# EAGLE design guider-shield (EAGLE 7.6.0)
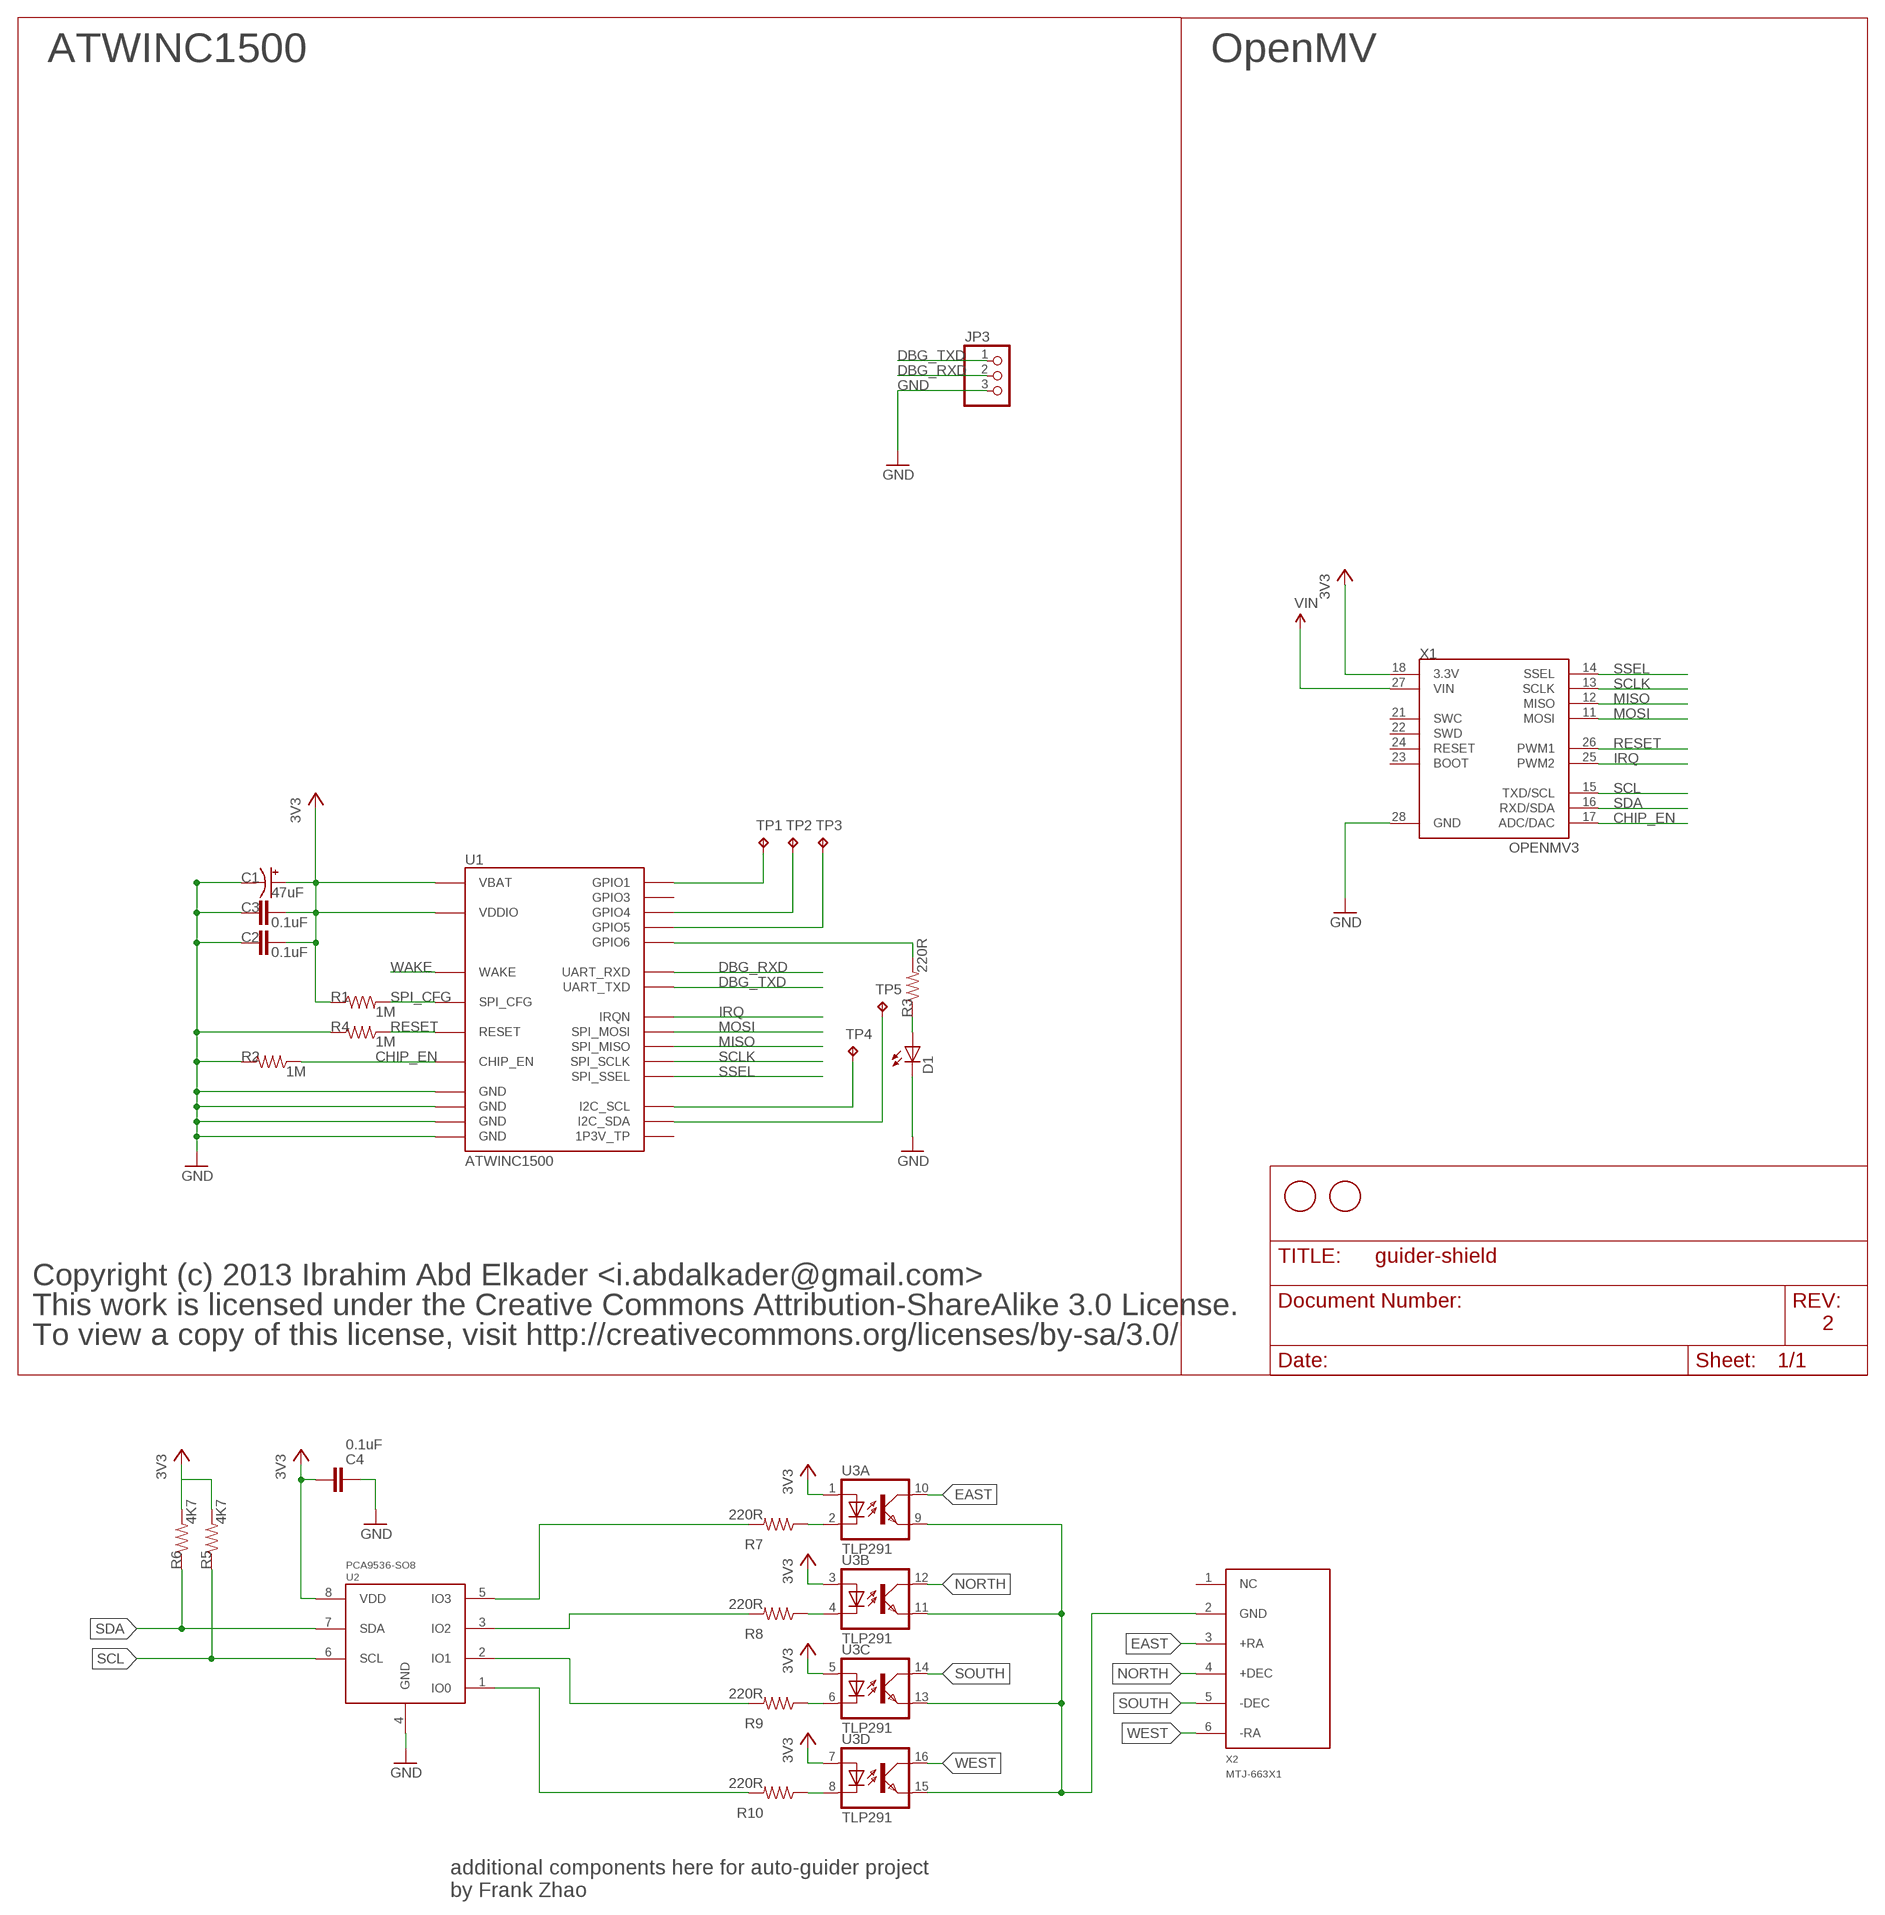
[diagram p0: schematic, sheet 1]

## Parts
C1  47uF  CAP_POL1206  [EIA3216]
C2  0.1uF  CAP0603-CAP  [0603-CAP]
C3  0.1uF  CAP0603-CAP  [0603-CAP]
C4  0.1uF  CAP0603-CAP  [0603-CAP]
D1  LED0603  [LED-0603]
JP3  PINHD-1X3  [1X03]
R1  1M  RESISTOR0603-RES  [0603-RES]
R2  1M  RESISTOR0603-RES  [0603-RES]
R3  220R  RESISTOR0603-RES  [0603-RES]
R4  1M  RESISTOR0603-RES  [0603-RES]
R5  4K7  RESISTOR0603-RES  [0603-RES]
R6  4K7  RESISTOR0603-RES  [0603-RES]
R7  220R  RESISTOR0603-RES  [0603-RES]
R8  220R  RESISTOR0603-RES  [0603-RES]
R9  220R  RESISTOR0603-RES  [0603-RES]
R10  220R  RESISTOR0603-RES  [0603-RES]
TP1  TPTP12R  [TP12R]
TP2  TPTP11R  [TP11R]
TP3  TPTP11R  [TP11R]
TP4  TPTP12R  [TP12R]
TP5  TPTP12R  [TP12R]
U1  ATWINC1500  [ATWINC1500]
U2  PCA9536-SO8  [SO08]
U3  TLP291  TLP283-4-SO016  [SO016]
U$1  FIDUCIAL  [FIDUCIAL_1MM]
U$2  FIDUCIAL  [FIDUCIAL_1MM]
X1  OPENMV3  [OPENMV3]
X2  MTJ-663X1  ST-4-MTJ-663X1  [MTJ-663X1]

## Nets
3V3: C1.A(+) C2.2 C3.2 C4.1 R1.1 R5.2 R6.2 U1.P$20(VBAT) U1.P$23(VDDIO) U2.8(VDD) U3.1(A:A) U3.3(B:A) U3.5(C:A) U3.7(D:A) X1.18(3.3V)
CHIP_EN: R2.1 U1.P$22(CHIP_EN) X1.17(ADC/DAC)
DBG_RXD: JP3.2 U1.P$19(UART_RXD)
DBG_TXD: JP3.1 U1.P$14(UART_TXD)
EAST: U3.10(A:COL) X2.3(+RA)
GND: C1.C(-) C2.1 C3.1 C4.2 D1.C JP3.3 R2.2 R4.2 U1.P$9(GND) U1.P$12(GND) U1.P$28(GND) U1.P$29(GND) U2.4(GND) X1.28(GND)
IRQ: U1.P$13(IRQN) X1.25(PWM2)
MISO: U1.P$17(SPI_MISO) X1.12(MISO)
MOSI: U1.P$15(SPI_MOSI) X1.11(MOSI)
N$1: R7.2 U2.5(IO3)
N$2: R8.2 U2.3(IO2)
N$8: R7.1 U3.2(A:C)
N$9: TP1.TP U1.P$21(GPIO1)
N$10: TP4.TP U1.P$2(I2C_SCL)
N$11: TP5.TP U1.P$3(I2C_SDA)
N$12: D1.A R3.1
N$13: TP2.TP U1.P$26(GPIO4)
N$14: TP3.TP U1.P$27(GPIO5)
N$15: R3.2 U1.P$1(GPIO6)
N$16: R8.1 U3.4(B:C)
N$20: R9.1 U3.6(C:C)
N$21: R10.1 U3.8(D:C)
N$22: R9.2 U2.2(IO1)
N$23: R10.2 U2.1(IO0)
N$24: U3.9(A:EMIT) U3.11(B:EMIT) U3.13(C:EMIT) U3.15(D:EMIT) X2.2(GND)
NORTH: U3.12(B:COL) X2.4(+DEC)
RESET: R4.1 U1.P$4(RESET) X1.26(PWM1)
SCL: R5.1 U2.6(SCL) X1.15(TXD/SCL)
SCLK: U1.P$18(SPI_SCLK) X1.13(SCLK)
SDA: R6.1 U2.7(SDA) X1.16(RXD/SDA)
SOUTH: U3.14(C:COL) X2.5(-DEC)
SPI_CFG: R1.2 U1.P$10(SPI_CFG)
SSEL: U1.P$16(SPI_SSEL) X1.14(SSEL)
VIN: X1.27(VIN)
WAKE: U1.P$11(WAKE)
WEST: U3.16(D:COL) X2.6(-RA)
Unconnected: U1.P$24(1P3V_TP) U1.P$25(GPIO3) X1.21(SWC) X1.22(SWD) X1.23(BOOT) X1.24(RESET) X2.1(NC)

## Notes on the sheet
- ATWINC1500 | OpenMV
- Copyright (c) 2013 Ibrahim Abd Elkader <i.abdalkader@gmail.com>
- This work is licensed under the Creative Commons Attribution-ShareAlike 3.0 License.
- 2
- To view a copy of this license, visit http://creativecommons.org/licenses/by-sa/3.0/
- additional components here for auto-guider project
  by Frank Zhao

## Library data of the parts
C1 = sfe:CAP_POL: Capacitor Polarized These are standard SMD and PTH capacitors. Normally 10uF, 47uF, and 100uF in electrolytic and tantalum varieties. Always verify the external diameter of the through hole cap, it varies with capacity, voltage, and manufacturer. The EIA devices should be standard.
C2-C4 = sfe:CAP: Capacitor Standard 0603 ceramic capacitor, and 0.1" leaded capacitor.
D1 = sfe:LED: LEDs Standard schematic elements and footprints for 5mm, 3mm, 1206, and 0603 sized LEDs. 5mm - Spark Fun Electronics SKU : COM-00529 (and others)
JP3 = adafruit-updated:PINHD-1X3: PIN HEADER
R1-R10 = sfe:RESISTOR: Resistor Basic schematic elements and footprints for 0603, 1206, and PTH resistors.
TP1-TP5 = testpad:TP: Test pad
U1 = mux:ATWINC1500
U2 = guider-shield:PCA9536
U3 = guider-shield:TLP283-4: TOSHIBA PHOTOCOUPLER GaAs IRED & PHOTO-TRANSISTOR Source: http://www.semicon.toshiba.co.jp/td/en/Opto/Photocoupler/en_20050928_TLP283_datasheet.pdf
U$1 U$2 = adafruit:FIDUCIAL: For use by pick and place machines to calibrate the vision/machine, 1mm By microbuilder.eu
X1 = openmv:OPENMV3
X2 = guider-shield:ST-4

## Net classes
1 vcc: width 1.016 mm, clearance 0.203 mm
2 antenna: width 0.363 mm, clearance 0.305 mm
3 1.8v: width 0.457 mm, clearance 0.254 mm

## Board
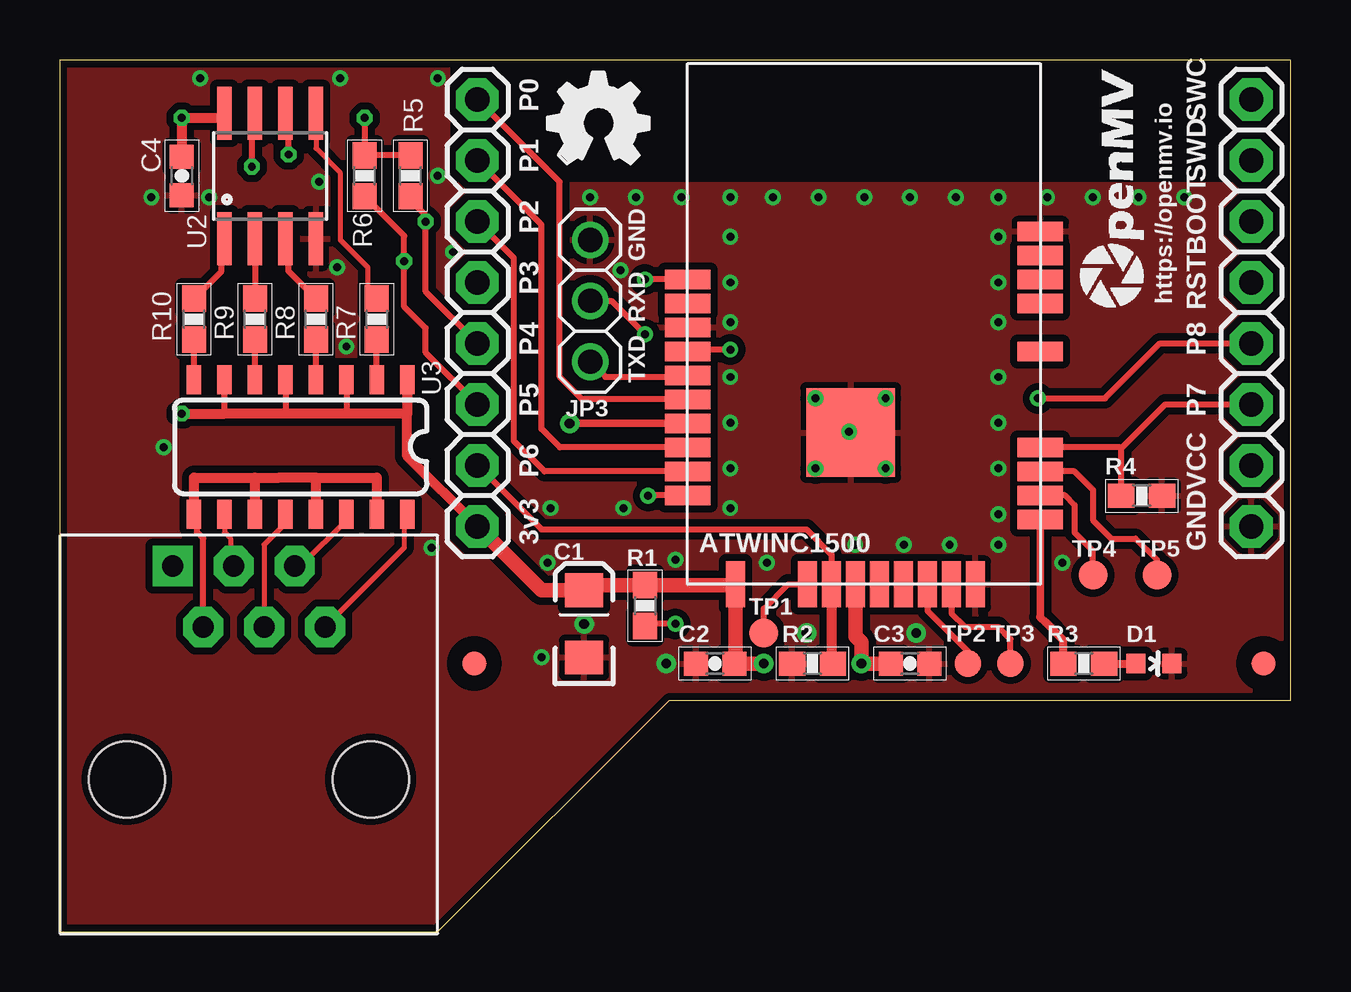
[diagram p1: board, top side]
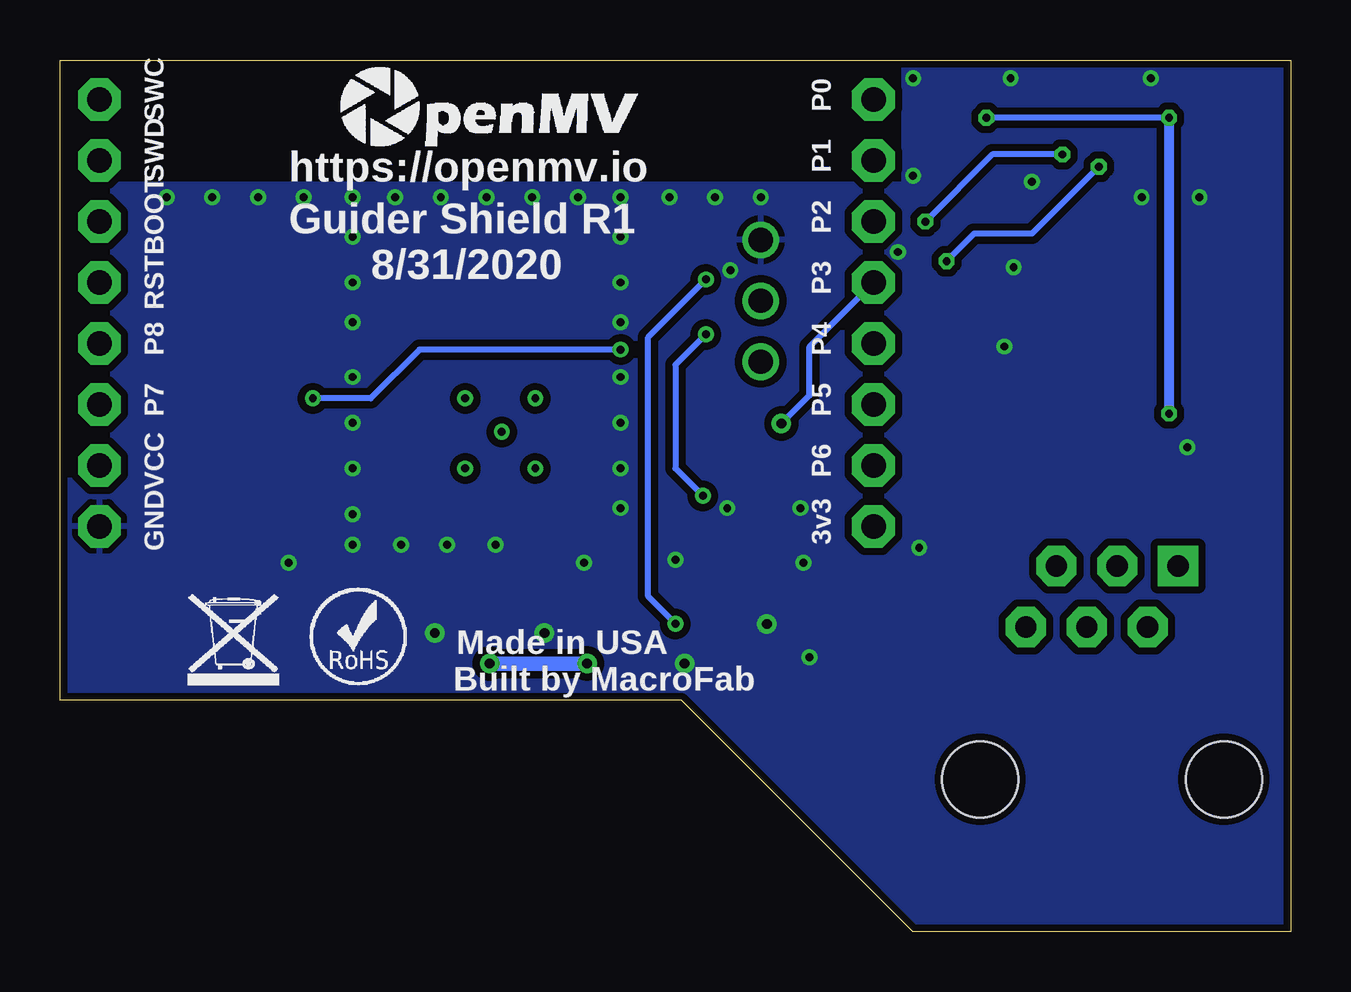
[diagram p2: board, bottom side, seen from below]

Size 51.31 x 36.32 mm. Coordinates in mm from the lower left corner, seen from the top.
Outline: 0,0 15.75,0 25.4,9.65 51.31,9.65 51.31,36.32 0,36.32 0,0
Copper layers (1*16): Top 0.035mm / dielectric 1.5mm / Bottom 0.035mm
Design rules "default": minimum track width 8mil, minimum drill 13mil, track to track 6mil, track to pad 6mil, pad to pad 6mil, via to via 6mil, smd to smd 6mil, copper to edge 5mil, drill to drill 10mil, minimum pad ring 10mil, minimum via ring 4mil, stop-mask expansion 2mil, vias tented up to drill 40mil, thermal gap 10mil

### Footprints (pad centres in the part's own frame; a part is rotated, then mirrored left to right if it is on the bottom)
EIA3216 = smd 1.4 x 1.6: A 1.4,0; C -1.4,0
0603-CAP = smd 1 x 1: 1 -0.8,0; 2 0.8,0
LED-0603 = smd 0.8 x 0.8: A 0,-0.75; C 0,0.75
1X03 = drill 1.016: 1 -2.54,0; 2 0,0; 3 2.54,0
0603-RES = smd 1.1 x 1: 1 -0.85,0; 2 0.85,0
TP12R = smd 1.2 x 1.2: TP 0,0
TP11R = smd 1.1 x 1.1: TP 0,0
ATWINC1500 = smd 1.9 x 0.8: P$1 14.7,2.7; P$2 14.7,3.7; P$3 14.7,4.7; P$4 14.7,5.7; P$5 14.7,9.7; P$6 14.7,11.7; P$7 14.7,12.7; P$8 14.7,13.7; P$9 14.7,14.7; P$10 0,12.7; P$11 0,11.7; P$12 0,10.7; P$13 0,9.7; P$14 0,8.7; P$15 0,7.7; P$16 0,6.7; P$17 0,5.7; P$18 0,4.7; P$19 0,3.7 | smd 0.8 x 1.9: P$20 2,0; P$21 5,0; P$22 6,0; P$23 7,0; P$24 8,0; P$25 9,0; P$26 10,0; P$27 11,0; P$28 12,0 | smd 3.7 x 3.7: P$29 6.8,6.32
SO08 = smd 0.61 x 2.21: 1 -1.905,-2.616; 2 -0.635,-2.616; 3 0.635,-2.616; 4 1.905,-2.616; 5 1.905,2.616; 6 0.635,2.616; 7 -0.635,2.616; 8 -1.905,2.616
SO016 = smd 0.6 x 1.2: 1 -4.445,-2.8; 2 -3.175,-2.8; 3 -1.905,-2.8; 4 -0.635,-2.8; 5 0.635,-2.8; 6 1.905,-2.8; 7 3.175,-2.8; 8 4.445,-2.8; 9 4.445,2.8; 10 3.175,2.8; 11 1.905,2.8; 12 0.635,2.8; 13 -0.635,2.8; 14 -1.905,2.8; 15 -3.175,2.8; 16 -4.445,2.8
FIDUCIAL_1MM = smd 1 x 1: 1 0,0
OPENMV3 = drill 1.016 pad 1.778 octagon: 11 1.651,19.304; 12 1.651,16.764; 13 1.651,14.224; 14 1.651,11.684; 15 1.651,9.144; 16 1.651,6.604; 17 1.651,4.064; 18 1.651,1.524; 21 33.909,19.304; 22 33.909,16.764; 23 33.909,14.224; 24 33.909,11.684; 25 33.909,9.144; 26 33.909,6.604; 27 33.909,4.064; 28 33.909,1.524
MTJ-663X1 = drill 0.889 pad 1.676 square: 1 -3.175,8.89 | drill 0.889 pad 1.676 octagon: 2 -1.905,6.35; 3 -0.635,8.89; 4 0.635,6.35; 5 1.905,8.89; 6 3.175,6.35 | hole 3.175: -5.08,0; 5.08,0

### Placement (x,y rotation side)
C1  21.84,12.83 90 top
C2  27.3,11.18 0 top
C3  35.43,11.18 180 top
C4  5.08,31.5 270 top
D1  45.59,11.18 270 top
JP3  22.1,26.29 90 top
R1  24.38,13.59 270 top
R2  31.37,11.18 180 top
R3  42.67,11.18 180 top
R4  45.09,18.16 0 top
R5  14.6,31.5 90 top
R6  12.7,31.5 90 top
R7  13.21,25.53 90 top
R8  10.67,25.53 90 top
R9  8.13,25.53 90 top
R10  5.59,25.53 90 top
TP1  29.34,12.45 0 top
TP2  37.85,11.18 0 top
TP3  39.62,11.18 0 top
TP4  43.05,14.86 0 top
TP5  45.72,14.86 0 top
U1  26.16,14.48 0 top
U2  8.76,31.5 0 top
U3  10.03,20.19 180 top
U$1  17.27,11.18 0 top
U$2  50.16,11.18 0 top
U$4  [OMV-LOGO]  39.75,32.51 0 bottom
U$5  [ROHS]  40.89,10.29 0 bottom
U$6  [WEEE]  45.97,10.29 0 bottom
U$7  [OSHW_FILLX150_NOTEXT]  20.32,32 0 top
U$10  [OMV-LOGO-SMALL]  45.34,25.91 90 top
X1  15.75,15.37 0 top
X2  7.87,6.35 0 top

### Tracks (layer width: path | path; a pad name or v marks a point on that pad's centre or on a via)
3V3  (via drill 0.33, 0.41)
  Top 0.254: 6.86,21.59 U3.7 | U3.5 9.4,21.59 | U3.3 11.94,21.59 | R5.2 R6.2 v12.7,33.91
  Top 0.406: U3.1 14.48,21.59 | 14.48,21.59 11.94,21.59 9.4,21.59 6.86,21.59 v5.08,21.59 | X1.18 14.48,19.81 14.48,21.59 | U2.8 6.86,33.91 v5.08,33.91 C4.1
  Top 0.61: C3.2 v33.4,11.18 33.4,12.06 33.16,12.3 U1.P$23 | v29.34,11.18 C2.2 28.16,11.23 U1.P$20 28.12,14.44 R1.1 22.06,14.44 C1.A 20.06,14.23 X1.18
  Bottom 0.254: v5.08,33.91 v12.7,33.91
  Bottom 0.406: v5.08,33.91 v5.08,21.59
  Bottom 0.61: v33.4,11.18 v29.34,11.18
CHIP_EN
  Top 0.254: U1.P$22 32.16,15.72 31.12,16.76 20.07,16.76 X1.17
  Top 0.406: U1.P$22 32.16,11.23 R2.1
DBG_RXD  (via drill 0.33)
  Top 0.254: U1.P$19 24.53,18.18 v24.51,18.16 | JP3.2 22.99,26.29 v24.38,24.89
  Bottom 0.254: v24.51,18.16 25.65,19.3 25.65,23.62 v24.38,24.89
DBG_TXD
  Top 0.254: JP3.1 22.73,23.11 26.1,23.11 U1.P$14
EAST
  Top 0.203: U3.10 6.86,16.64 7.11,16.38 7.11,15.37 X2.3
GND  (via drill 0.33, 0.41)
  other vias: 41.78,15.37 20.32,15.37 21.84,12.83 22.1,30.61 24,30.61 25.91,30.61 27.94,30.61 29.72,30.61 37.34,30.61 39.12,30.61 41.15,30.61 43.05,30.61 44.96,30.61 46.86,30.61 35.43,30.61 33.53,30.61 31.62,30.61 39.12,28.96 27.94,28.96 39.12,19.3 39.12,17.4 35.69,12.45 29.46,15.37 27.94,21.21 39.12,23.11 39.12,27.05 39.12,25.4 27.94,27.05 27.94,25.4 27.94,19.3 39.12,21.21 25.65,15.49 27.94,17.65 27.94,23.11 23.37,27.56 33.15,16.13 23.49,17.65 35.18,16.13 37.08,16.13 39.12,16.13 25.27,11.18 31.12,12.45 20.45,17.65 11.94,24.38 11.56,27.69 6.22,30.61 3.81,30.61 15.75,31.5 11.68,35.56 15.75,35.56 4.32,20.19 5.84,35.56 10.79,31.24 16.38,28.32 15.49,16 20.07,11.43
  pour Top (isolate 0.305, rank 2): 0,0 0,36.32 16.13,36.32 16.13,31.12 51.31,31.12 51.31,9.65 25.4,9.65 15.75,0
  pour Bottom (isolate 0.305, rank 2): 0,0 0,36.32 16.13,36.32 16.13,31.12 51.31,31.12 51.31,9.65 25.4,9.65 15.75,0
IRQ  (via drill 0.33)
  Top 0.254: v27.94,24.26 26.24,24.26 U1.P$13 | v40.77,22.23 43.56,22.23 45.85,24.51 X1.25
  Bottom 0.254: v27.94,24.26 36.32,24.26 38.35,22.23 v40.77,22.23
MISO
  Top 0.254: U1.P$17 20.84,20.18 20.07,20.95 20.07,29.46 X1.12
MOSI
  Top 0.254: U1.P$15 21.76,22.18 20.83,23.11 20.83,31.24 X1.11
N$1
  Top 0.203: U2.5 10.67,32.64 11.68,31.62 11.68,28.83 12.83,27.69 12.83,26.76 R7.2
N$2
  Top 0.254: R8.2 9.52,27.52 9.52,28.88 U2.3
N$3  (via drill 0.33)
  other vias: 34.42,22.23
N$4  (via drill 0.33)
  other vias: 31.5,22.23
N$5  (via drill 0.33)
  other vias: 31.5,19.3
N$6  (via drill 0.33)
  other vias: 34.42,19.3
N$7  (via drill 0.33)
  other vias: 32.89,20.83
N$8
  Top 0.254: U3.2 R7.1
N$9
  Top 0.254: TP1.TP 29.34,13.46 30.35,14.48 U1.P$21
N$10
  Top 0.254: TP4.TP 43.05,15.88 42.29,16.64 42.29,17.78 41.89,18.18 U1.P$2
N$11
  Top 0.254: TP5.TP 45.72,15.49 44.83,16.38 43.81,16.38 43.05,17.14 43.05,18.41 42.29,19.18 U1.P$3
N$12
  Top 0.33: R3.1 D1.A
N$13
  Top 0.254: U1.P$26 36.16,13.37 37.85,11.68 TP2.TP
N$14
  Top 0.254: TP3.TP 39.62,12.19 39.12,12.7 37.72,12.7 37.16,13.26 U1.P$27
N$15
  Top 0.305: U1.P$1 40.86,13.11
  Top 0.33: 40.86,13.11 41.09,12.89 41.82,12.15 R3.2
N$16
  Top 0.254: U3.4 R8.1
N$20
  Top 0.254: U3.6 R9.1
N$21
  Top 0.254: U3.8 R10.1
N$22
  Top 0.254: U2.2 R9.2
N$23
  Top 0.254: R10.2 6.73,27.52 6.73,28.88 U2.1
N$24
  Top 0.254: X2.2 5.97,16.38 5.71,16.64 5.71,16.89 5.59,17.02 U3.9
  Top 0.406: U3.9 5.59,18.92 8.13,18.92 | 10.67,18.92 13.21,18.92 U3.15 | U3.13 10.67,18.92 | 10.67,18.92 9.14,18.92 8.13,18.92 | U3.11 8.13,18.92
NORTH
  Top 0.203: U3.12 9.4,17.02 8.51,16.13 X2.4
RESET
  Top 0.254: R4.1 44.23,20.14 | 44.23,20.14 44.2,20.18 U1.P$4 | 44.23,20.14 46.07,21.97 X1.26
SCL  (via drill 0.33)
  Top 0.254: X1.15 15.24,26.67 v15.24,29.59 15.24,29.84 14.6,30.48 R5.1 | v9.52,32.38 9.52,34.11 U2.6
  Bottom 0.254: v9.52,32.38 12.45,32.38 v15.24,29.59
SCLK
  Top 0.254: U1.P$18 20.19,19.18 18.92,20.45 18.92,28.07 X1.13
SDA  (via drill 0.33)
  Top 0.254: X1.16 15.24,24.13 15.24,25.15 14.35,26.03 v14.35,27.94 14.35,28.99 R6.1 | v8,31.88 8,34.11 U2.7
  Bottom 0.254: v8,31.88 10.79,29.08 13.21,29.08 v14.35,27.94
SOUTH
  Top 0.203: U3.14 11.94,17.14 10.03,15.24 X2.5
SPI_CFG  (via drill 0.33)
  Top 0.254: v25.65,12.83 24.47,12.83 R1.2 | U1.P$10 v24.38,27.18
  Bottom 0.254: v25.65,12.83 26.8,13.97 26.8,24.77 v24.38,27.18
SSEL  (via drill 0.41)
  Top 0.305: U1.P$16 v21.24,21.18
  Bottom 0.254: v21.24,21.18 20.07,22.35 20.07,24.38 X1.14
WEST
  Top 0.203: U3.16 14.35,17.27 14.35,16 X2.6

### Text on the board
tPlace: P0 | SWC | P1 | SWD | P2 | BOOT | GND | P3 | https://openmv.io | RXD | RST | P4 | P8 | TXD | P5 | P7 | P6 | VCC | 3v3 | ATWINC1500 | GND
bPlace: P0 | SWC | P1 | https://openmv.io | SWD | P2 | Guider Shield R1 | BOOT | 8/31/2020 | P3 | RST | P4 | P8 | P5 | P7 | P6 | VCC | 3v3 | GND | Made in USA | Built by MacroFab